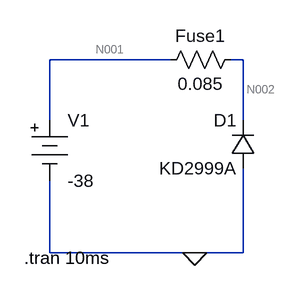
[diagram p0: schematic LM317HC2.asc]
LM317HC2.asc, the LTspice schematic file:
Version 4
SHEET 1 880 680
WIRE 176 64 16 64
WIRE 272 64 256 64
WIRE 16 144 16 64
WIRE 272 144 272 64
WIRE 16 320 16 224
WIRE 208 320 16 320
WIRE 272 320 272 208
WIRE 272 320 208 320
FLAG 208 320 0
SYMBOL res 272 48 R90
WINDOW 0 0 56 VBottom 2
WINDOW 3 32 56 VTop 2
SYMATTR InstName Fuse1
SYMATTR Value 0.085
SYMBOL Misc\\battery 16 128 R0
WINDOW 123 0 0 Left 0
WINDOW 39 0 0 Left 0
SYMATTR InstName V1
SYMATTR Value -38
SYMBOL diode 288 208 R180
WINDOW 0 24 64 Left 2
WINDOW 3 24 0 Left 2
SYMATTR InstName D1
SYMATTR Value KD2999A
TEXT -18 326 Left 2 !.tran 10ms

The netlist it stands for:
* LM317HC2.asc
R§Fuse1 N002 N001 0.085
V1 N001 0 -38
D1 0 N002 KD2999A
.model D D
.lib standard.dio
.tran 10ms
.backanno
.end

* Results of the author's LTspice run, read from the files saved beside the schematic
* Operating Point, zero values left out:
*   V(n002) = -3.302 V
*   V(n001) = -38 V
*   I(D1) = 408.2 A
*   I(Fuse1) = 408.2 A
*   I(V1) = 408.2 A